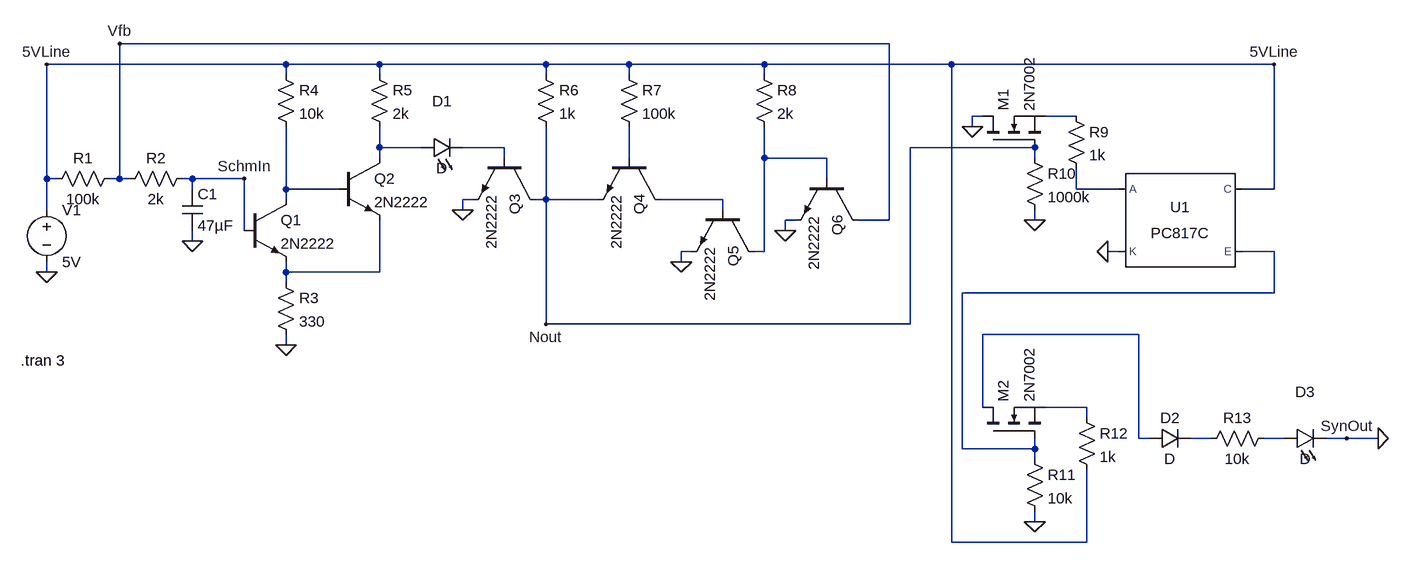
[diagram p0: schematic NeuronSynapseVersion3.asc]
NeuronSynapseVersion3.asc, the LTspice schematic file:
Version 4.1
SHEET 1 2404 680
WIRE 1440 -128 256 -128
WIRE 512 -96 144 -96
WIRE 656 -96 512 -96
WIRE 912 -96 656 -96
WIRE 1040 -96 912 -96
WIRE 1248 -96 1040 -96
WIRE 1536 -96 1248 -96
WIRE 2032 -96 1536 -96
WIRE 512 -80 512 -96
WIRE 656 -80 656 -96
WIRE 912 -80 912 -96
WIRE 1040 -80 1040 -96
WIRE 1248 -80 1248 -96
WIRE 1584 -16 1568 -16
WIRE 1728 -16 1680 -16
WIRE 1568 0 1568 -16
WIRE 656 32 656 0
WIRE 720 32 656 32
WIRE 848 32 784 32
WIRE 1664 32 1472 32
WIRE 656 48 656 32
WIRE 848 48 848 32
WIRE 1040 48 1040 0
WIRE 1248 48 1248 0
WIRE 1344 48 1248 48
WIRE 1664 48 1664 32
WIRE 144 80 144 -96
WIRE 160 80 144 80
WIRE 256 80 256 -128
WIRE 256 80 240 80
WIRE 272 80 256 80
WIRE 368 80 352 80
WIRE 448 80 368 80
WIRE 1344 80 1344 48
WIRE 368 96 368 80
WIRE 512 96 512 0
WIRE 592 96 512 96
WIRE 1728 96 1728 64
WIRE 1792 96 1728 96
WIRE 2032 96 2032 -96
WIRE 2032 96 1984 96
WIRE 512 112 512 96
WIRE 800 112 784 112
WIRE 912 112 912 0
WIRE 912 112 896 112
WIRE 992 112 912 112
WIRE 1184 112 1088 112
WIRE 144 128 144 80
WIRE 784 128 784 112
WIRE 1184 128 1184 112
WIRE 1296 144 1280 144
WIRE 1440 144 1440 -128
WIRE 1440 144 1392 144
WIRE 1664 144 1664 128
WIRE 448 160 448 80
WIRE 1280 160 1280 144
WIRE 368 176 368 160
WIRE 1136 192 1120 192
WIRE 1248 192 1248 48
WIRE 1248 192 1232 192
WIRE 1792 192 1776 192
WIRE 2032 192 1984 192
WIRE 1120 208 1120 192
WIRE 144 224 144 208
WIRE 512 224 512 208
WIRE 656 224 656 144
WIRE 656 224 512 224
WIRE 512 240 512 224
WIRE 2032 256 2032 192
WIRE 2032 256 1552 256
WIRE 912 304 912 112
WIRE 1472 304 1472 32
WIRE 1472 304 912 304
WIRE 1824 320 1584 320
WIRE 512 336 512 320
WIRE 1584 432 1584 320
WIRE 1744 432 1680 432
WIRE 1744 448 1744 432
WIRE 1824 480 1824 320
WIRE 1840 480 1824 480
WIRE 1936 480 1904 480
WIRE 2048 480 2016 480
WIRE 2144 480 2112 480
WIRE 2192 480 2144 480
WIRE 1552 496 1552 256
WIRE 1664 496 1664 480
WIRE 1664 496 1552 496
WIRE 1664 512 1664 496
WIRE 1664 608 1664 592
WIRE 1536 640 1536 -96
WIRE 1744 640 1744 528
WIRE 1744 640 1536 640
FLAG 144 224 0
FLAG 368 176 0
FLAG 512 336 0
FLAG 784 128 0
FLAG 1120 208 0
FLAG 1280 160 0
FLAG 912 304 Nout
FLAG 1568 0 0
FLAG 1664 144 0
FLAG 448 80 SchmIn
FLAG 144 -96 5VLine
FLAG 256 -128 Vfb
FLAG 1664 608 0
FLAG 2144 480 SynOut
FLAG 2192 480 0
FLAG 2032 -96 5VLine
FLAG 1776 192 0
SYMBOL voltage 144 112 R0
WINDOW 123 0 0 Left 0
WINDOW 39 0 0 Left 0
SYMATTR InstName V1
SYMATTR Value 5V
SYMBOL res 256 64 R90
WINDOW 0 0 56 VBottom 2
WINDOW 3 32 56 VTop 2
SYMATTR InstName R1
SYMATTR Value 100k
SYMBOL res 368 64 R90
WINDOW 0 0 56 VBottom 2
WINDOW 3 32 56 VTop 2
SYMATTR InstName R2
SYMATTR Value 2k
SYMBOL cap 352 96 R0
SYMATTR InstName C1
SYMATTR Value 47µF
SYMBOL npn 448 112 R0
SYMATTR InstName Q1
SYMATTR Value 2N2222
SYMBOL res 496 224 R0
SYMATTR InstName R3
SYMATTR Value 330
SYMBOL npn 592 48 R0
SYMATTR InstName Q2
SYMATTR Value 2N2222
SYMBOL res 640 -96 R0
SYMATTR InstName R5
SYMATTR Value 2k
SYMBOL res 496 -96 R0
SYMATTR InstName R4
SYMATTR Value 10k
SYMBOL LED 720 48 R270
WINDOW 0 72 32 VTop 2
WINDOW 3 0 32 VBottom 2
SYMATTR InstName D1
SYMBOL npn 896 48 R90
SYMATTR InstName Q3
SYMATTR Value 2N2222
SYMBOL res 896 -96 R0
SYMATTR InstName R6
SYMATTR Value 1k
SYMBOL npn 1088 48 R90
SYMATTR InstName Q4
SYMATTR Value 2N2222
SYMBOL res 1024 -96 R0
SYMATTR InstName R7
SYMATTR Value 100k
SYMBOL npn 1232 128 R90
SYMATTR InstName Q5
SYMATTR Value 2N2222
SYMBOL res 1232 -96 R0
SYMATTR InstName R8
SYMATTR Value 2k
SYMBOL npn 1392 80 R90
SYMATTR InstName Q6
SYMATTR Value 2N2222
SYMBOL nmos 1584 32 R270
SYMATTR InstName M1
SYMATTR Value 2N7002
SYMBOL res 1712 -32 R0
SYMATTR InstName R9
SYMATTR Value 1k
SYMBOL res 1648 32 R0
SYMATTR InstName R10
SYMATTR Value 1000k
SYMBOL Optos\\PC817C 1888 144 R0
SYMATTR InstName U1
SYMBOL nmos 1584 480 R270
SYMATTR InstName M2
SYMATTR Value 2N7002
SYMBOL res 1648 496 R0
SYMATTR InstName R11
SYMATTR Value 10k
SYMBOL res 1728 432 R0
SYMATTR InstName R12
SYMATTR Value 1k
SYMBOL diode 1840 496 R270
WINDOW 0 32 32 VTop 2
WINDOW 3 0 32 VBottom 2
SYMATTR InstName D2
SYMBOL res 2032 464 R90
WINDOW 0 0 56 VBottom 2
WINDOW 3 32 56 VTop 2
SYMATTR InstName R13
SYMATTR Value 10k
SYMBOL LED 2048 496 R270
WINDOW 0 72 32 VTop 2
WINDOW 3 0 32 VBottom 2
SYMATTR InstName D3
TEXT 104 360 Left 2 !.tran 3

The netlist it stands for:
* NeuronSynapseVersion3.asc
V1 5VLine 0 5V
R1 Vfb 5VLine 100k
R2 SchmIn Vfb 2k
C1 SchmIn 0 47µF
Q1 N006 SchmIn N010 0 2N2222
R3 N010 0 330
Q2 N002 N006 N010 0 2N2222
R5 5VLine N002 2k
R4 5VLine N006 10k
D1 N002 N003 D
Q3 Nout N003 0 0 2N2222
R6 5VLine Nout 1k
Q4 N008 N004 Nout 0 2N2222
R7 5VLine N004 100k
Q5 N005 N008 0 0 2N2222
R8 5VLine N005 2k
Q6 Vfb N005 0 0 2N2222
M1 0 Nout N001 N001 2N7002
R9 N001 N007 1k
R10 Nout 0 1000k
X§U1 N007 0 5VLine N009 PC817 Igain=2.3m  ; PC817C, pins A K C E
M2 N011 N009 N012 N012 2N7002
R11 N009 0 10k
R12 N012 5VLine 1k
D2 N011 N013 D
R13 N014 N013 10k
D3 N014 0 D
.model D D
.lib standard.dio
.model NPN NPN
.model PNP PNP
.lib standard.bjt
.model NMOS NMOS
.model PMOS PMOS
.lib standard.mos
.tran 3
.lib PC817.sub
.backanno
.end